# EasyEDA schematic schematic.json
TITLE: The Trail UV Water Bottle!; REV: 1.0; Date: 2024-04-25; Sheet: 1/1; Drawn By: john.tanaristy; Company: Your Company
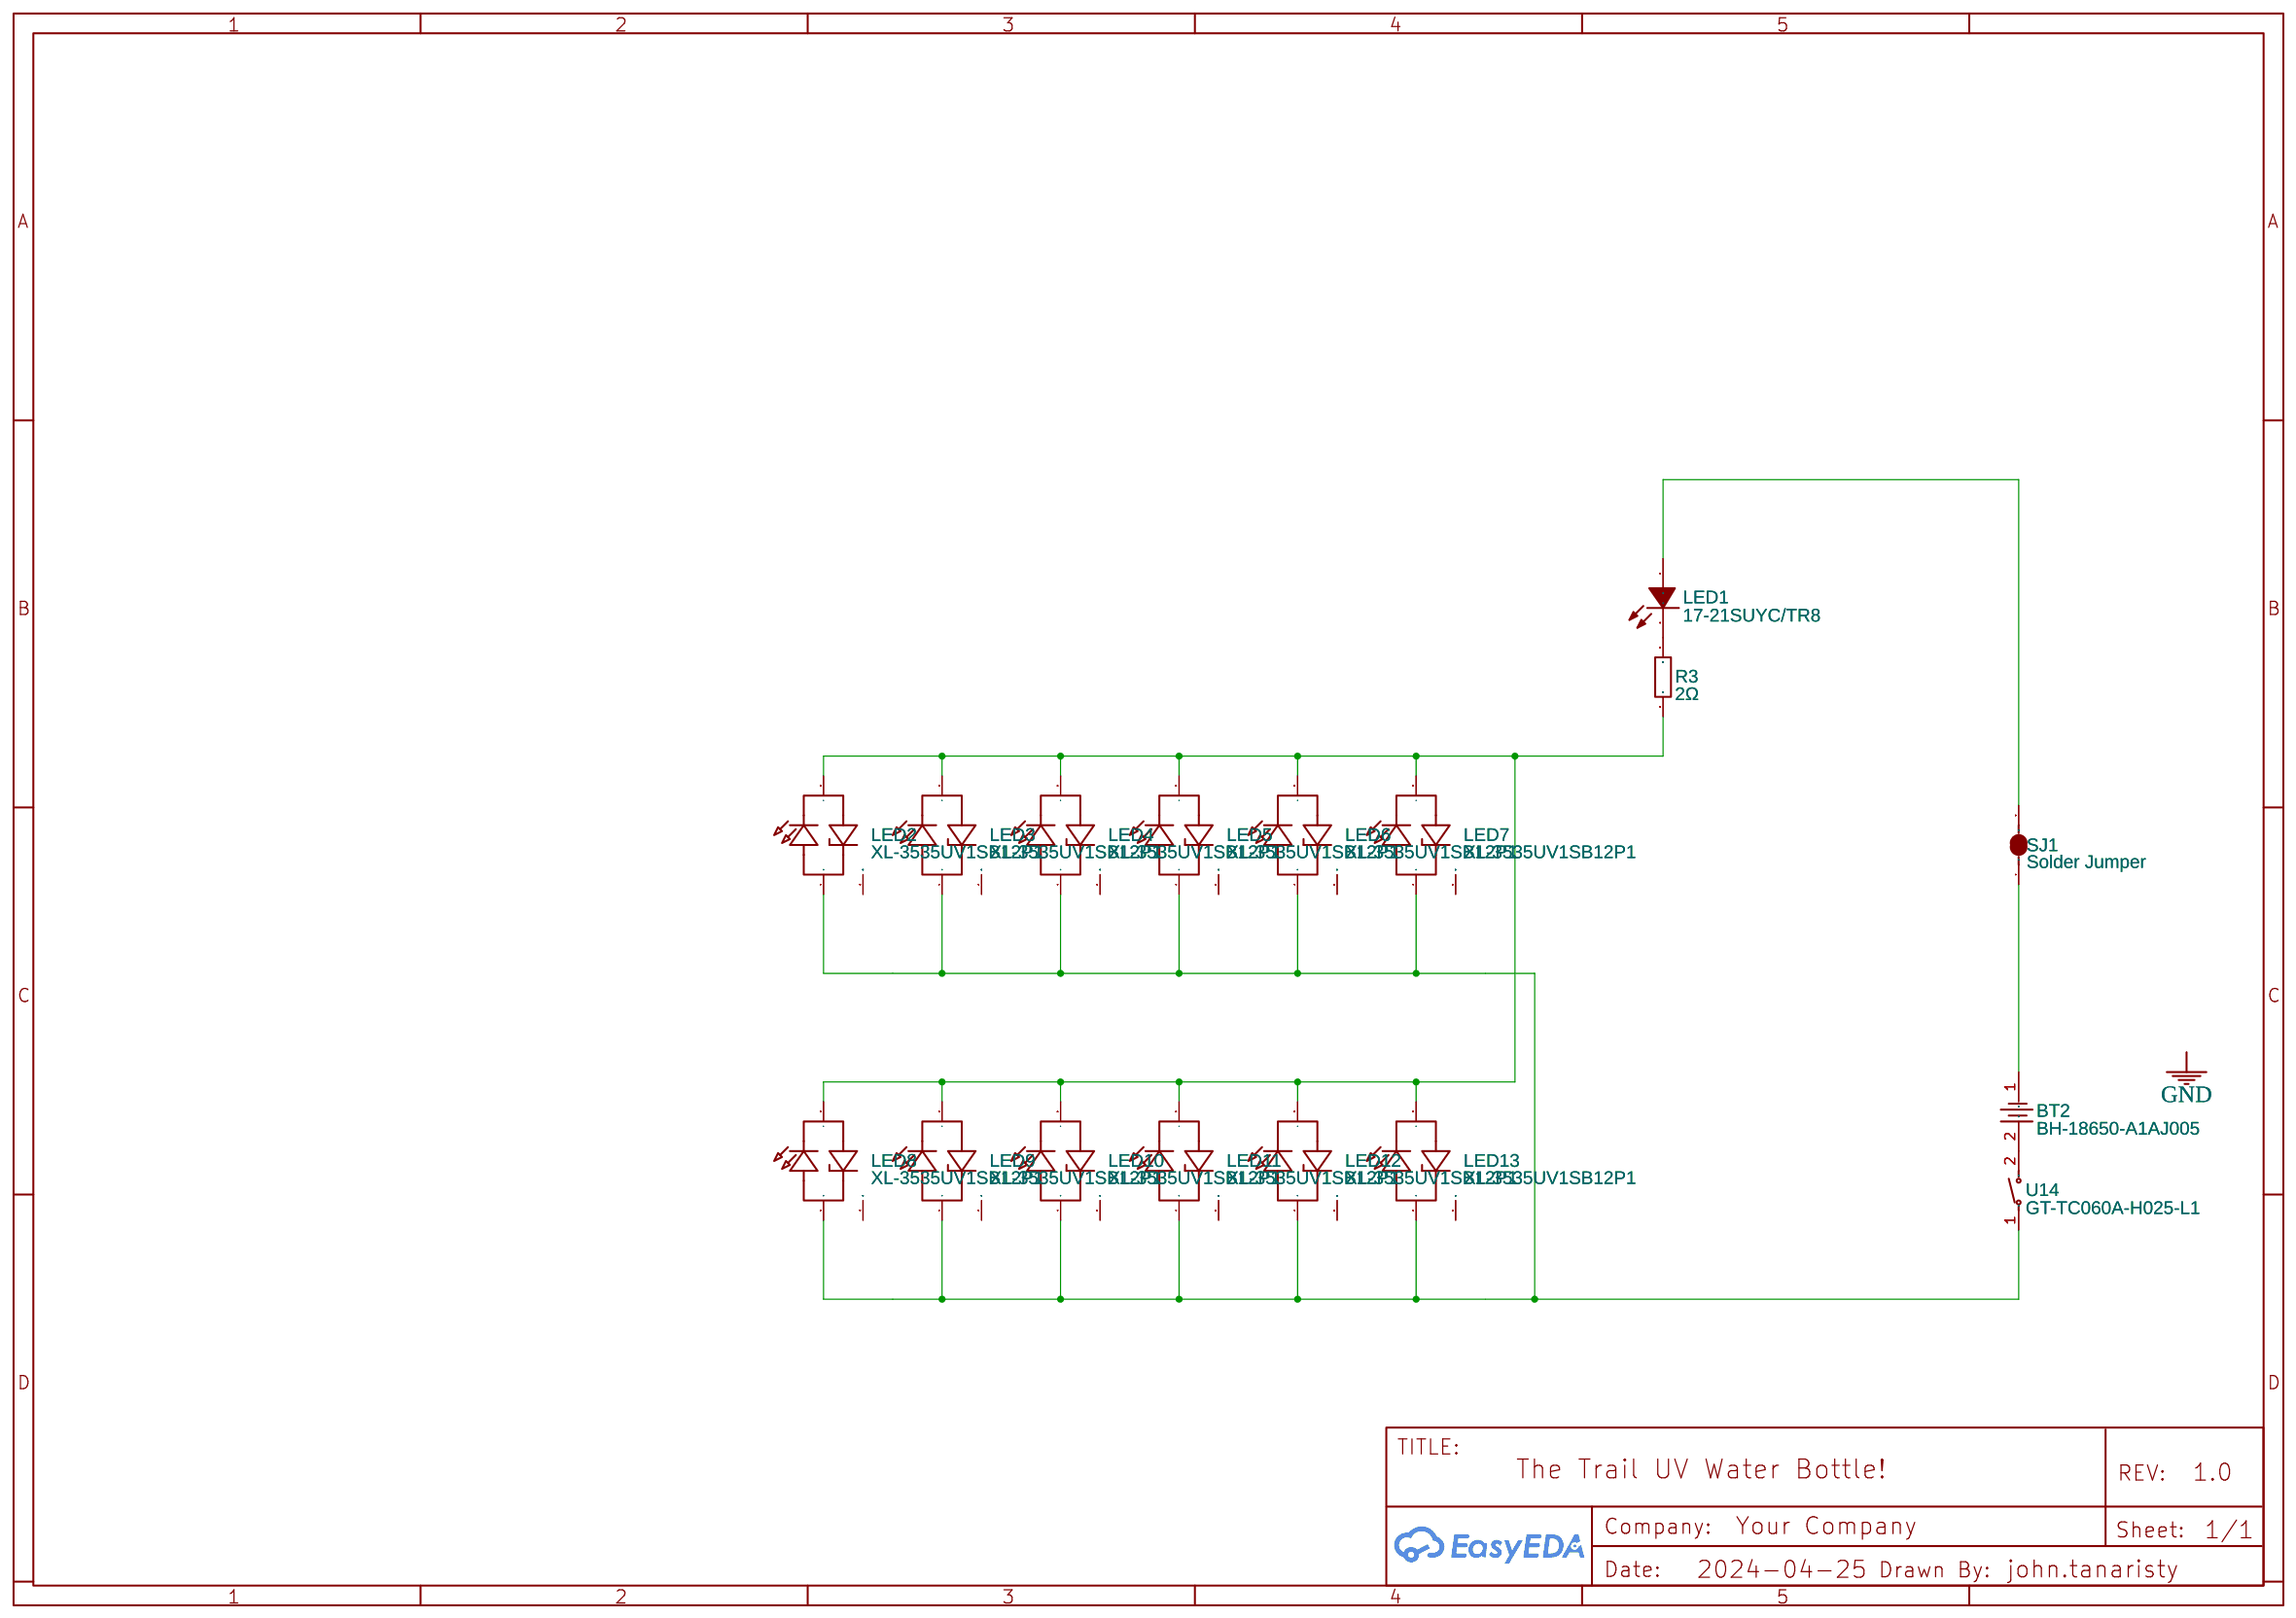
[diagram p0: schematic sheet]

## Parts
BT2  BH-18650-A1AJ005  [BAT-TH_BH-18650-A1AJ005]
LED1  17-21SUYC/TR8  [LED0805-R-RD]
LED2  XL-3535UV1SB12P1  [LED-SMD_XL-3535UV1SB12P1]
LED3  XL-3535UV1SB12P1  [LED-SMD_XL-3535UV1SB12P1]
LED4  XL-3535UV1SB12P1  [LED-SMD_XL-3535UV1SB12P1]
LED5  XL-3535UV1SB12P1  [LED-SMD_XL-3535UV1SB12P1]
LED6  XL-3535UV1SB12P1  [LED-SMD_XL-3535UV1SB12P1]
LED7  XL-3535UV1SB12P1  [LED-SMD_XL-3535UV1SB12P1]
LED8  XL-3535UV1SB12P1  [LED-SMD_XL-3535UV1SB12P1]
LED9  XL-3535UV1SB12P1  [LED-SMD_XL-3535UV1SB12P1]
LED10  XL-3535UV1SB12P1  [LED-SMD_XL-3535UV1SB12P1]
LED11  XL-3535UV1SB12P1  [LED-SMD_XL-3535UV1SB12P1]
LED12  XL-3535UV1SB12P1  [LED-SMD_XL-3535UV1SB12P1]
LED13  XL-3535UV1SB12P1  [LED-SMD_XL-3535UV1SB12P1]
R3  2Ω  [R0603]
SJ1  Solder Jumper  [SOLDERJUMPER]
U14  GT-TC060A-H025-L1  [SW-SMD_L6.1-W3.5-LS8.0]

## Library data of the parts
BT2 = BH-18650-A1AJ005: Supplier: LCSC; Supplier Part: C5290176; Manufacturer: MYOUNG(美阳); JLCPCB Part Class: Extended Part; Contributor: lcsc
LED1 = 17-21SUYC/TR8: Supplier: LCSC; Manufacturer: KENTO; Manufacturer Part: KT-0805黄灯; Supplier Part: C2296; JLCPCB Part Class: Basic Part
LED2-LED13 = XL-3535UV1SB12P1: Contributor: LCSC; Supplier: LCSC; Supplier Part: C962563; Manufacturer: XINGLIGHT(成兴光); JLCPCB Part Class: Extended Part
R3 = 0603WAF200KT5E: Supplier: LCSC; Manufacturer: UNI-ROYAL(厚声); Supplier Part: C22977; JLCPCB Part Class: Basic Part
SJ1 = Solder Jumper: Contributor: gilatoes
U14 = GT-TC060A-H025-L1: Contributor: lcsc; Supplier: LCSC; Supplier Part: C5117870; Manufacturer: G-Switch(品赞); JLCPCB Part Class: Extended Part

## Nets
Net-(BT2-1): BT2.1 SJ1.1
Net-(BT2-2): BT2.2 U14.2
Net-(LED1-1): LED1.1(+) SJ1.2
Net-(LED1-2): LED1.2(-) R3.2
Net-(LED2-1): LED2.1(+) LED3.1(+) LED4.1(+) LED5.1(+) LED6.1(+) LED7.1(+) LED8.1(+) LED9.1(+) LED10.1(+) LED11.1(+) LED12.1(+) LED13.1(+) U14.1
Net-(LED2-2): LED2.2(-) LED3.2(-) LED4.2(-) LED5.2(-) LED6.2(-) LED7.2(-) LED8.2(-) LED9.2(-) LED10.2(-) LED11.2(-) LED12.2(-) LED13.2(-) R3.1

Not connected (* = marked no-connect by the designer): LED2 3; LED3 3; LED4 3; LED5 3; LED6 3; LED7 3; LED8 3; LED9 3; LED10 3; LED11 3; LED12 3; LED13 3
